# Altium project S06S-Controller.PrjPcb
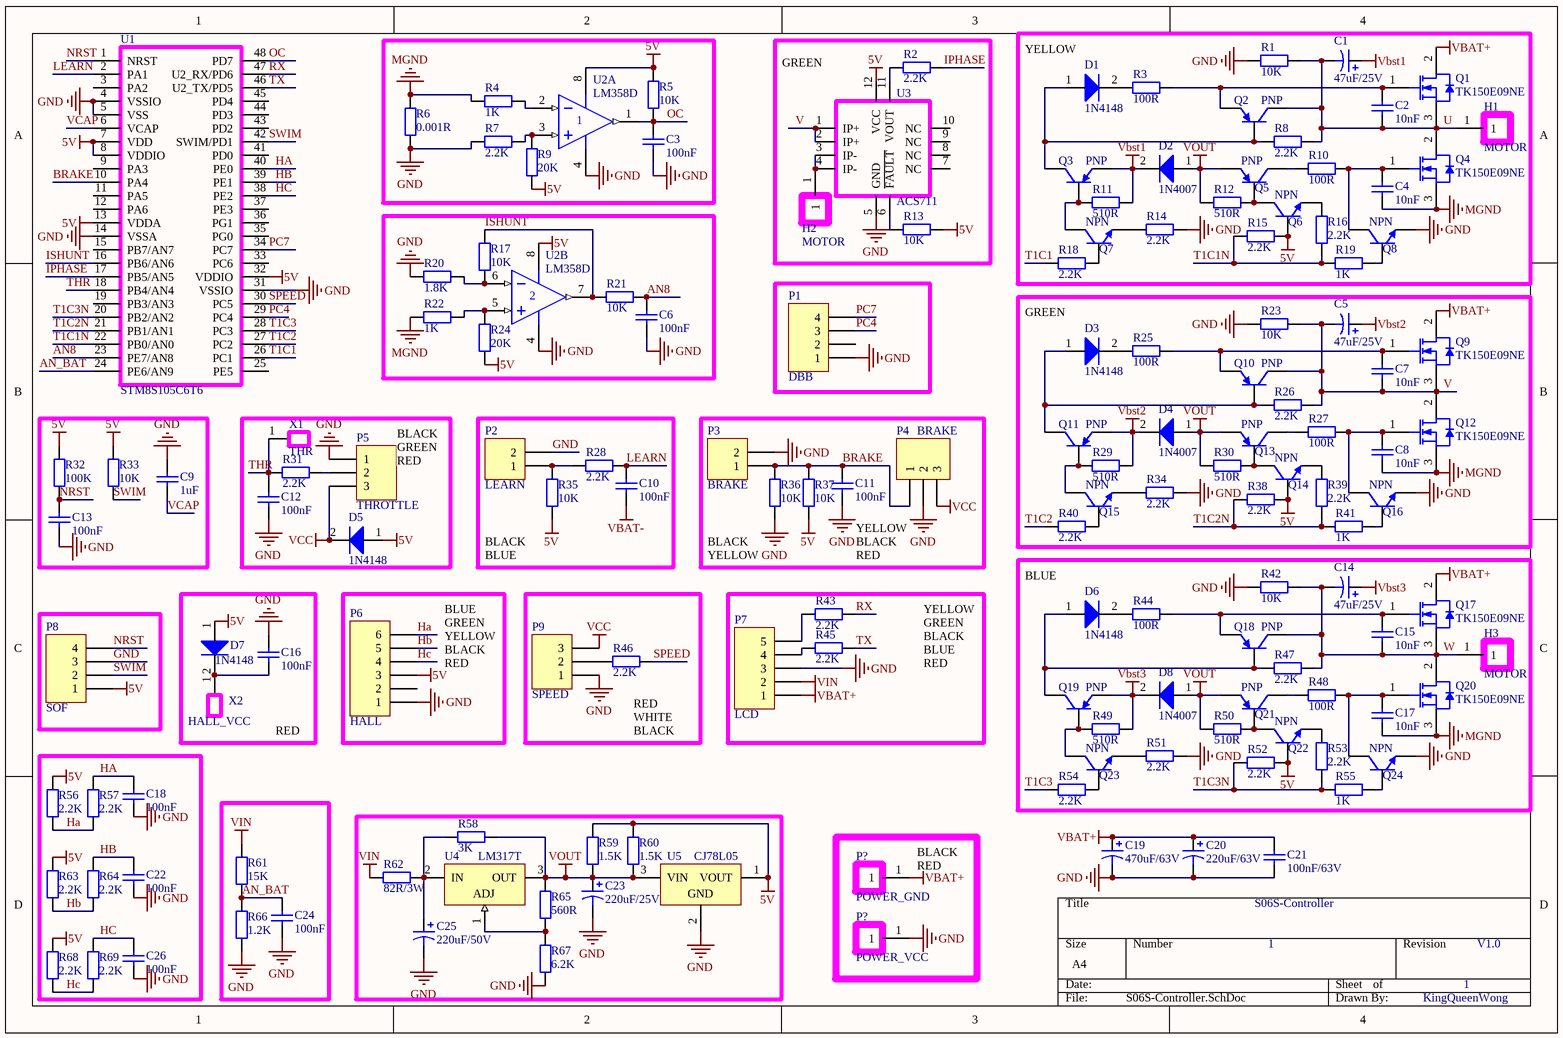
[diagram p0: S06S-Controller.SchDoc]
1 sheet, 148 parts. Net scope: global (net labels, ports and power ports of the same name join across sheets).
Board file: S06S-Controller.PcbDoc

## Sheet S06S-Controller.SchDoc
size A4

### Parts
(Parts that share a designator on the sheet are numbered #1, #2 ... from top to bottom, then left to right.)
C1  value 47uF/25V  [RB7.6-15]  (hidden comment: Cap Pol1)
C2  value 10nF  [0603C]  (hidden comment: Cap)
C3  value 100nF  [0603C]  (hidden comment: Cap)
C4  value 10nF  [0603C]  (hidden comment: Cap)
C5  value 47uF/25V  [RB7.6-15]  (hidden comment: Cap Pol1)
C6  value 100nF  [0603C]  (hidden comment: Cap)
C7  value 10nF  [0603C]  (hidden comment: Cap)
C8  value 10nF  [0603C]  (hidden comment: Cap)
C9  value 1uF  [0603C]  (hidden comment: Cap)
C10  value 100nF  [0603C]  (hidden comment: Cap)
C11  value 100nF  [0603C]  (hidden comment: Cap)
C12  value 100nF  [0603C]  (hidden comment: Cap)
C13  value 100nF  [0603C]  (hidden comment: Cap)
C14  value 47uF/25V  [RB7.6-15]  (hidden comment: Cap Pol1)
C15  value 10nF  [0603C]  (hidden comment: Cap)
C16  value 100nF  [0603C]  (hidden comment: Cap)
C17  value 10nF  [0603C]  (hidden comment: Cap)
C18  value 100nF  [0603C]  (hidden comment: Cap)
C19  value 470uF/63V  [RB7.6-15]  (hidden comment: Cap Pol1)
C20  value 220uF/63V  [RB7.6-15]  (hidden comment: Cap Pol1)
C21  value 100nF/63V  [0603C]  (hidden comment: Cap)
C22  value 100nF  [0603C]  (hidden comment: Cap)
C23  value 220uF/25V  [RB7.6-15]  (hidden comment: Cap Pol1)
C24  value 100nF  [0603C]  (hidden comment: Cap)
C25  value 220uF/50V  [RB7.6-15]  (hidden comment: Cap Pol1)
C26  value 100nF  [0603C]  (hidden comment: Cap)
D1  1N4148  [SOD80C]
D2  1N4007  [SOD80C]
D3  1N4148  [SOD80C]
D4  1N4007  [SOD80C]
D5  1N4148  [SOD80C]
D6  1N4148  [SOD80C]
D7  1N4148  [SOD80C]
D8  1N4007  [SOD80C]
H1  MOTOR  [MOTOR]
H2  MOTOR  [MOTOR]
H3  MOTOR  [MOTOR]
P1  DBB  [HDR1X4]
P2  LEARN  [HDR1X2]
P3  BRAKE  [HDR1X2]
P4  BRAKE  [HDR1X3]
P5  THROTTLE  [HDR1X3]
P6  HALL  [HDR1X6]
P7  LCD  [HDR1X5]
P8  SOF  [HDR1X4]
P9  SPEED  [HDR1X3]
P?#1  POWER_GND  [POWER]
P?#2  POWER_VCC  [POWER]
Q1  TK150E09NE  [TO220ABN]
Q2  PNP  [SOT23]
Q3  PNP  [SOT23]
Q4  TK150E09NE  [TO220ABN]
Q5  PNP  [SOT23]
Q6  NPN  [SOT23]
Q7  NPN  [SOT23]
Q8  NPN  [SOT23]
Q9  TK150E09NE  [TO220ABN]
Q10  PNP  [SOT23]
Q11  PNP  [SOT23]
Q12  TK150E09NE  [TO220ABN]
Q13  PNP  [SOT23]
Q14  NPN  [SOT23]
Q15  NPN  [SOT23]
Q16  NPN  [SOT23]
Q17  TK150E09NE  [TO220ABN]
Q18  PNP  [SOT23]
Q19  PNP  [SOT23]
Q20  TK150E09NE  [TO220ABN]
Q21  PNP  [SOT23]
Q22  NPN  [SOT23]
Q23  NPN  [SOT23]
Q24  NPN  [SOT23]
R1  value 10K  [0603R]  (hidden comment: Res2)
R2  value 2.2K  [0603R]  (hidden comment: Res2)
R3  value 100R  [0603R]  (hidden comment: Res2)
R4  value 1K  [0603R]  (hidden comment: Res2)
R5  value 10K  [0603R]  (hidden comment: Res2)
R6  value 0.001R  [0603R]  (hidden comment: Res2)
R7  value 2.2K  [0603R]  (hidden comment: Res2)
R8  value 2.2K  [0603R]  (hidden comment: Res2)
R9  value 20K  [0603R]  (hidden comment: Res2)
R10  value 100R  [0603R]  (hidden comment: Res2)
R11  value 510R  [0603R]  (hidden comment: Res2)
R12  value 510R  [0603R]  (hidden comment: Res2)
R13  value 10K  [0603R]  (hidden comment: Res2)
R14  value 2.2K  [0603R]  (hidden comment: Res2)
R15  value 2.2K  [0603R]  (hidden comment: Res2)
R16  value 2.2K  [0603R]  (hidden comment: Res2)
R17  value 10K  [0603R]  (hidden comment: Res2)
R18  value 2.2K  [0603R]  (hidden comment: Res2)
R19  value 1K  [0603R]  (hidden comment: Res2)
R20  value 1.8K  [0603R]  (hidden comment: Res2)
R21  value 10K  [0603R]  (hidden comment: Res2)
R22  value 1K  [0603R]  (hidden comment: Res2)
R23  value 10K  [0603R]  (hidden comment: Res2)
R24  value 20K  [0603R]  (hidden comment: Res2)
R25  value 100R  [0603R]  (hidden comment: Res2)
R26  value 2.2K  [0603R]  (hidden comment: Res2)
R27  value 100R  [0603R]  (hidden comment: Res2)
R28  value 2.2K  [0603R]  (hidden comment: Res2)
R29  value 510R  [0603R]  (hidden comment: Res2)
R30  value 510R  [0603R]  (hidden comment: Res2)
R31  value 2.2K  [0603R]  (hidden comment: Res2)
R32  value 100K  [0603R]  (hidden comment: Res2)
R33  value 10K  [0603R]  (hidden comment: Res2)
R34  value 2.2K  [0603R]  (hidden comment: Res2)
R35  value 10K  [0603R]  (hidden comment: Res2)
R36  value 10K  [0603R]  (hidden comment: Res2)
R37  value 10K  [0603R]  (hidden comment: Res2)
R38  value 2.2K  [0603R]  (hidden comment: Res2)
R39  value 2.2K  [0603R]  (hidden comment: Res2)
R40  value 2.2K  [0603R]  (hidden comment: Res2)
R41  value 1K  [0603R]  (hidden comment: Res2)
R42  value 10K  [0603R]  (hidden comment: Res2)
R43  value 2.2K  [0603R]  (hidden comment: Res2)
R44  value 100R  [0603R]  (hidden comment: Res2)
R45  value 2.2K  [0603R]  (hidden comment: Res2)
R46  value 2.2K  [0603R]  (hidden comment: Res2)
R47  value 2.2K  [0603R]  (hidden comment: Res2)
R48  value 100R  [0603R]  (hidden comment: Res2)
R49  value 510R  [0603R]  (hidden comment: Res2)
R50  value 510R  [0603R]  (hidden comment: Res2)
R51  value 2.2K  [0603R]  (hidden comment: Res2)
R52  value 2.2K  [0603R]  (hidden comment: Res2)
R53  value 2.2K  [0603R]  (hidden comment: Res2)
R54  value 2.2K  [0603R]  (hidden comment: Res2)
R55  value 1K  [0603R]  (hidden comment: Res2)
R56  value 2.2K  [0603R]  (hidden comment: Res2)
R57  value 2.2K  [0603R]  (hidden comment: Res2)
R58  value 3K  [0603R]  (hidden comment: Res2)
R59  value 1.5K  [0603R]  (hidden comment: Res2)
R60  value 1.5K  [0603R]  (hidden comment: Res2)
R61  value 15K  [0603R]  (hidden comment: Res2)
R62  value 82R/3W  [0603R]  (hidden comment: Res2)
R63  value 2.2K  [0603R]  (hidden comment: Res2)
R64  value 2.2K  [0603R]  (hidden comment: Res2)
R65  value 560R  [0603R]  (hidden comment: Res2)
R66  value 1.2K  [0603R]  (hidden comment: Res2)
R67  value 6.2K  [0603R]  (hidden comment: Res2)
R68  value 2.2K  [0603R]  (hidden comment: Res2)
R69  value 2.2K  [0603R]  (hidden comment: Res2)
U1  STM8S105C6T6  [TQFP-48]
U2  LM358D  [751-02_N]  (parts A,B of 2)
U3  ACS711  [QFN12]
U4  LM317T  [TO220ABN]
U5  CJ78L05  [TO-92]
X1  THR  [HDR1X1]
X2  HALL_VCC  [HDR1X1]

### Nets
5V: D5.1 D7.1 P6.3 P8.1 Q6.2(B) Q14.2(B) Q22.2(B) R5.2 R9.1 R13.1 R15.2 R24.1 R32.1 R33.1 R35.1 R37.1 R38.2 R52.2 R56.1 R59.2 R60.2 R63.1 R68.1 U1.7(VDD) U1.8(VDDIO) U1.13(VDDA) U1.32(VDDIO) U2.8(V+) U3.12(VCC) U5.1(VOUT)
GND: C3.2 C6.2 C9.1 C11.2 C12.2 C13.2 C16.2 C18.2 C19.2 C20.2 C21.2 C22.2 C23.2 C24.2 C25.2 C26.2 P1.1 P2.2 P3.2 P4.2 P5.1 P6.1 P7.3 P8.3 P9.1 P?#2.1 Q8.3(E) Q16.3(E) Q24.3(E) R1.2 R6.2 R7.2 R14.1 R20.2 R23.2 R34.1 R36.1 R42.2 R51.1 R66.1 R67.2 U1.4(VSSIO) U1.5(VSS) U1.14(VSSA) U1.31(VSSIO) U2.4(V-) U3.5(GND) U5.2(GND)
MGND: C4.2 C8.2 C17.2 Q4.3(SOURCE) Q12.3(SOURCE) Q20.3(SOURCE) R4.2 R6.1 R22.2
VBAT+: C19.1 C20.1 C21.1 P7.1 P?#1.1 Q1.2(DRAIN) Q9.2(DRAIN) Q17.2(DRAIN)
VBAT-: C10.2
Vbst1: C1.1 D2.2 Q3.3(E) R11.1
Vbst2: C5.1 D4.2 Q11.3(E) R29.1
Vbst3: C14.1 D8.2 Q19.3(E) R49.1
VCC: D5.2 P4.3 P5.3 P9.3
VIN: P7.2 R61.2 R62.1
VOUT: C23.1 D2.1 D4.1 D8.1 Q5.3(E) Q13.3(E) Q21.3(E) R12.2 R30.2 R50.2 R58.1 R59.1 R60.1 R65.1 U4.3(OUT) U5.3(VIN)
AN8: C6.1 R21.2 U1.23(PE7/AN8)
AN_BAT: C24.1 R61.1 R66.2 U1.24(PE6/AN9)
BRAKE: C11.1 P3.1 P4.1 R36.2 R37.2 U1.10(PA4)
HA: C18.1 P6.6 R56.2 R57.1 R57.2 U1.40(PE0)
HB: C22.1 P6.5 R63.2 R64.1 R64.2 U1.39(PE1)
HC: C26.1 P6.4 R68.2 R69.1 R69.2 U1.38(PE2)
IPHASE: R2.1 U1.17(PB5/AN5)
ISHUNT: R17.2 R21.1 U1.16(PB6/AN6) U2.7(OUT)
LEARN: C10.1 R28.2 U1.2(PA1)
NRST: C13.1 P8.4 R32.2 U1.1(NRST)
OC: C3.1 R5.1 U1.48(PD7) U2.1(OUT)
PC4: P1.3 U1.29(PC4)
PC7: P1.4 U1.34(PC7)
RX: R43.2 U1.47(U2_RX/PD6)
SPEED: R46.2 U1.30(PC5)
SWIM: P8.2 R33.2 U1.42(SWIM/PD1)
T1C1: R18.1 U1.26(PC1)
T1C1N: R15.1 R16.1 R19.1 U1.22(PB0/AN0)
T1C2: R40.1 U1.27(PC2)
T1C2N: R38.1 R39.1 R41.1 U1.21(PB1/AN1)
T1C3: R54.1 U1.28(PC3)
T1C3N: R52.1 R53.1 R55.1 U1.20(PB2/AN2)
THR: C12.1 R31.1 U1.18(PB4/AN4) X1.1
TX: R45.2 U1.46(U2_TX/PD5)
U: C1.2 C2.2 H1.1 Q1.3(SOURCE) Q2.1(C) Q4.2(DRAIN) R1.1 R8.2
V: C5.2 C7.2 Q9.3(SOURCE) Q10.1(C) Q12.2(DRAIN) R23.1 R26.2 U3.1(IP+) U3.2(IP+)
VCAP: C9.2 U1.6(VCAP)
W: C14.2 C15.2 H3.1 Q17.3(SOURCE) Q18.1(C) Q20.2(DRAIN) R42.1 R47.2
NetC2_1: C2.1 Q1.1(GATE) Q2.3(E) R3.1
NetC4_1: C4.1 Q4.1(GATE) Q8.1(C) R10.1
NetC7_1: C7.1 Q9.1(GATE) Q10.3(E) R25.1
NetC8_1: C8.1 Q12.1(GATE) Q16.1(C) R27.1
NetC15_1: C15.1 Q17.1(GATE) Q18.3(E) R44.1
NetC16_1: C16.1 D7.2 X2.1
NetC17_1: C17.1 Q20.1(GATE) Q24.1(C) R48.1
NetC25_1: C25.1 R58.2 R62.2 U4.2(IN)
NetD1_1: D1.1 Q2.2(B) Q3.1(C) R8.1
NetD1_2: D1.2 R3.2
NetD3_1: D3.1 Q10.2(B) Q11.1(C) R26.1
NetD3_2: D3.2 R25.2
NetD6_1: D6.1 Q18.2(B) Q19.1(C) R47.1
NetD6_2: D6.2 R44.2
NetH2_1: H2.1 U3.3(IP-) U3.4(IP-)
NetP2_1: P2.1 R28.1 R35.2
NetP5_2: P5.2 R31.2
NetP7_4: P7.4 R45.1
NetP7_5: P7.5 R43.1
NetP9_2: P9.2 R46.1
NetQ3_2: Q3.2(B) Q7.1(C) R11.2
NetQ5_1: Q5.1(C) R10.2
NetQ5_2: Q5.2(B) Q6.1(C) R12.1
NetQ6_3: Q6.3(E) R16.2
NetQ7_2: Q7.2(B) R18.2
NetQ7_3: Q7.3(E) R14.2
NetQ8_2: Q8.2(B) R19.2
NetQ11_2: Q11.2(B) Q15.1(C) R29.2
NetQ13_1: Q13.1(C) R27.2
NetQ13_2: Q13.2(B) Q14.1(C) R30.1
NetQ14_3: Q14.3(E) R39.2
NetQ15_2: Q15.2(B) R40.2
NetQ15_3: Q15.3(E) R34.2
NetQ16_2: Q16.2(B) R41.2
NetQ19_2: Q19.2(B) Q23.1(C) R49.2
NetQ21_1: Q21.1(C) R48.2
NetQ21_2: Q21.2(B) Q22.1(C) R50.1
NetQ22_3: Q22.3(E) R53.2
NetQ23_2: Q23.2(B) R54.2
NetQ23_3: Q23.3(E) R51.2
NetQ24_2: Q24.2(B) R55.2
NetR2_2: R2.2 U3.11(VOUT)
NetR4_1: R4.1 U2.2(IN-)
NetR7_1: R7.1 R9.2 U2.3(IN+)
NetR13_2: R13.2 U3.6(~{FAULT})
NetR17_1: R17.1 R20.1 U2.6(IN-)
NetR22_1: R22.1 R24.2 U2.5(IN+)
NetR65_2: R65.2 R67.1 U4.1(ADJ)

Not connected (* = marked no-connect by the designer): P1 2; P6 2; U1 3(PA2) 9(PA3) 11(PA5) 12(PA6) 15(PB7/AN7) 19(PB3/AN3) 25(PE5) 33(PC6) 35(PG0) 36(PG1) 37(PE3) 41(PD0) 43(PD2) 44(PD3) 45(PD4); U3 7(NC) 8(NC) 9(NC) 10(NC)

### Notes on the sheet
- (near U3) GREEN
- (near D1) YELLOW
- GREEN
- (near P5) BLACK
  GREEN
  RED
- (near R35) BLACK
  BLUE
- (near R36) BLACK
  YELLOW
- YELLOW
  BLACK
  RED
- BLUE
- BLUE
  GREEN
  YELLOW
  BLACK
  RED
- YELLOW
  GREEN
  BLACK
  BLUE
  RED
- RED
- (near R46) RED
  WHITE
  BLACK
- (near P?#1) BLACK
  RED
- (near C21) S06S-Controller
- 1
- V1.0
- KingQueenWong

### Library data of the parts
C1 C5 C14 C19 C20 C23 C25 = Cap Pol1: Polarized Capacitor (Radial); Published: 8-Jun-2000; LatestRevisionDate: 17-Jul-2002; LatestRevisionNote: Re-released for DXP Platform.; PackageReference: RB7.6-15; Publisher: Altium Limited; PackageDescription: Polarized Capacitor (Radial); 2 Leads
C2-C4 C6-C13 C15-C18 C21 C22 C24 C26 = Cap: Capacitor; Published: 8-Jun-2000; LatestRevisionDate: 17-Jul-2002; LatestRevisionNote: Re-released for DXP Platform.; PackageReference: RAD-0.3; Publisher: Altium Limited; PackageDescription: Radial Cap, Thru-Hole; 2 Leads; 0.3 in Pin Spacing
D2 D4 D8 = 1N4148
P1 P8 = Header 4: Header, 4-Pin; LatestRevisionDate: 17-Jul-2002; LatestRevisionNote: Re-released for DXP Platform.; Publisher: Altium Limited
P2 P3 = Header 2: Header, 2-Pin; LatestRevisionDate: 17-Jul-2002; LatestRevisionNote: Re-released for DXP Platform.; Publisher: Altium Limited
P4 P5 P9 = Header 3: Header, 3-Pin; LatestRevisionDate: 17-Jul-2002; LatestRevisionNote: Re-released for DXP Platform.; Publisher: Altium Limited
P6 = Header 6: Header, 6-Pin; LatestRevisionDate: 17-Jul-2002; LatestRevisionNote: Re-released for DXP Platform.; Publisher: Altium Limited
P7 = Header 5: Header, 5-Pin; LatestRevisionDate: 17-Jul-2002; LatestRevisionNote: Re-released for DXP Platform.; Publisher: Altium Limited
Q2 Q3 Q5 Q10 Q11 Q13 Q18 Q19 Q21 = PNP: PNP Bipolar Transistor; Published: 8-Jun-2000; LatestRevisionDate: 29-May-2009; LatestRevisionNote: IPC-7351 Footprint Added.; PackageVersion: Aug-1999; PackageReference: SOT-23B; Publisher: Altium Limited; PackageDescription: 3-Pin SOT-23 Package 0.95 mm Pitch, 2.4 mm Lead Span
Q6-Q8 Q14-Q16 Q22-Q24 = NPN: NPN Bipolar Transistor; Published: 8-Jun-2000; LatestRevisionDate: 17-Jul-2002; LatestRevisionNote: Re-released for DXP Platform.; PackageReference: TO-226-AA; Publisher: Altium Limited; PackageDescription: TO, Flat Index; 3 In-Line, Axial Leads; Body Dia. 4.8mm; Leads 0.55 x 0.51 mm (max); Code_JEDEC: TO-226-AA
R1-R69 = Res2: Resistor; Published: 8-Jun-2000; LatestRevisionDate: 17-Jul-2002; LatestRevisionNote: Re-released for DXP Platform.; PackageReference: AXIAL-0.4; Publisher: Altium Limited; PackageDescription: Axial Device, Thru-Hole; 2 Leads; 0.4 in Pin Spacing
U2 = LM358D: Dual Low-Power Operational Amplifier; Published: 17-Jul-2002; LatestRevisionDate: 13-Apr-2006; LatestRevisionNote: IPC-7351 Footprint Added.; DatasheetVersion: 1988; PackageReference: 751-02; Publisher: Altium Limited; PackageDescription: 8-Pin Small Outline Integrated Circuit 1.27 mm Pitch; Code_JEDEC: MS-012-AA; Code_IPC: SOIC127P600-8; ComponentLink1Description: Manufacturer Link; ComponentLink1URL: http://www.onsemi.com/site/products/parametrics/0,4446,251,00.html; ComponentLink2Description: Datasheet; ComponentLink2URL: http://www.onsemi.com/pub/Collateral/LM358-D.PDF
U4 = LM317T: 1.2V to 37V Voltage Regulator; Note: Tab is connected to pin 3 (OUT).; Published: 24-Aug-2001; LatestRevisionDate: 17-Jul-2002; LatestRevisionNote: Re-released for DXP Platform.; DatasheetVersion: Nov-1999; PackageVersion: Jun-1998; PackageReference: TO220ABN; Publisher: Altium Limited; PackageDescription: TO, Thru-Hole, Vertical, Heatsink Mounted; 3 In-Line Leads; Pitch 2.54 mm; Pin sequence 1, 3, 2; ComponentLink1Description: Manufacturer Link; ComponentLink1URL: http://www.st.com/; ComponentLink2Description: Datasheet; ComponentLink2URL: http://www.st.com/stonline/products/literature/ds/2154/lm117.pdf
U5 = L78L05ACZ-AP: Positive Voltage Regulator, 5V, 3-Pin TO-92; DatasheetVersion: Feb-2011; PackageVersion: 2011; PackageReference: TO-92; PackageDescription: TO, Flat Index; 3 In-Line, Axial Leads; Body Dia. 4.7mm; Lead Dia. 0.56 mm (max); PartNumber: L78L05ACZ-AP; ComponentLink1Description: Manufacturer URL; ComponentLink1URL: http://www.st.com; ComponentLink2Description: Datasheet; ComponentLink2URL: http://www.st.com/internet/com/TECHNICAL_RESOURCES/TECHNICAL_LITERATURE/DATASHEET/CD00000446.pdf
X1 X2 = 1P